# Altium schematic sheet ADC.SchDoc: Analog to Digital Conversion
size B; DrawnBy: Jasper Yun; SheetNumber: 9; SheetTotal: 11; Competition: SAC 2021; Subteam: Avionics; University: McGill University; Location: Montreal, Quebec; Project: Avionics Project Name; MRT: McGill Rocket Team
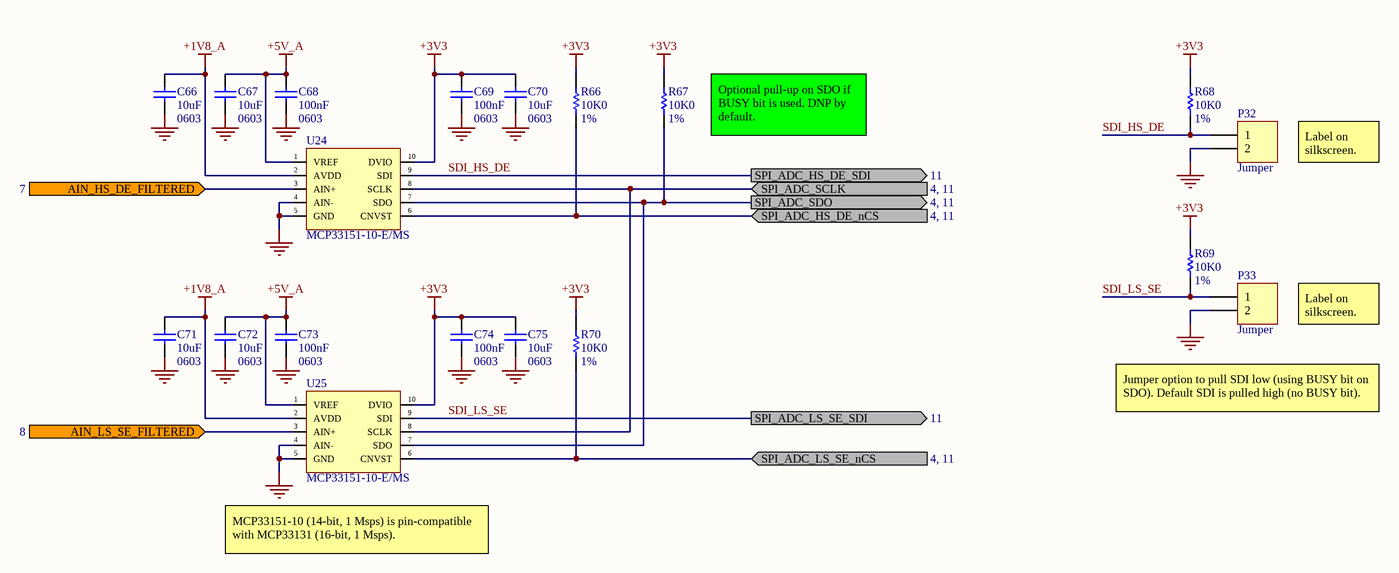
[diagram p0: ADC.SchDoc]

## Parts
C66  10uF  value 0603  [0603 CAP SAMSUNG CL10C]
C67  10uF  value 0603  [0603 CAP SAMSUNG CL10C]
C68  100nF  value 0603  [0603 CAP SAMSUNG CL10C]
C69  100nF  value 0603  [0603 CAP SAMSUNG CL10C]
C70  10uF  value 0603  [0603 CAP SAMSUNG CL10C]
C71  10uF  value 0603  [0603 CAP SAMSUNG CL10C]
C72  10uF  value 0603  [0603 CAP SAMSUNG CL10C]
C73  100nF  value 0603  [0603 CAP SAMSUNG CL10C]
C74  100nF  value 0603  [0603 CAP SAMSUNG CL10C]
C75  10uF  value 0603  [0603 CAP SAMSUNG CL10C]
P32  Jumper  [HDR1X2]
P33  Jumper  [HDR1X2]
R66  10K0  value 1%  [0603 RES]
R67  10K0  value 1%  [0603 RES]
R68  10K0  value 1%  [0603 RES]
R69  10K0  value 1%  [0603 RES]
R70  10K0  value 1%  [0603 RES]
U24  MCP33151-10-E/MS  [MSOP-10]
U25  MCP33151-10-E/MS  [MSOP-10]

## Ports
AIN_HS_DE_FILTERED (in, see 7), AIN_LS_SE_FILTERED (in, see 8), SPI_ADC_HS_DE_nCS (in, see 4, 11), SPI_ADC_HS_DE_SDI (out, see 11), SPI_ADC_LS_SE_nCS (in, see 4, 11), SPI_ADC_LS_SE_SDI (out, see 11), SPI_ADC_SCLK (in, see 4, 11), SPI_ADC_SDO (out, see 4, 11)

## Nets
+1V8_A: C66.2 C71.2 U24.2(AVDD) U25.2(AVDD)
+3V3: C69.2 C70.2 C74.2 C75.2 R66.2 R67.2 R68.2 R69.2 R70.2 U24.10(DVIO) U25.10(DVIO)
+5V_A: C67.2 C68.2 C72.2 C73.2 U24.1(VREF) U25.1(VREF)
GND: C66.1 C67.1 C68.1 C69.1 C70.1 C71.1 C72.1 C73.1 C74.1 C75.1 P32.2 P33.2 U24.4(AIN-) U24.5(GND) U25.4(AIN-) U25.5(GND)
AIN_HS_DE_FILTERED: U24.3(AIN+) ; port AIN_HS_DE_FILTERED
AIN_LS_SE_FILTERED: U25.3(AIN+) ; port AIN_LS_SE_FILTERED
SDI_HS_DE: P32.1 R68.1 U24.9(SDI) ; port SPI_ADC_HS_DE_SDI
SDI_LS_SE: P33.1 R69.1 U25.9(SDI) ; port SPI_ADC_LS_SE_SDI
SPI_ADC_HS_DE_nCS: R66.1 U24.6(CNVST) ; port SPI_ADC_HS_DE_nCS
SPI_ADC_LS_SE_nCS: R70.1 U25.6(CNVST) ; port SPI_ADC_LS_SE_nCS
SPI_ADC_SCLK: U24.8(SCLK) U25.8(SCLK) ; port SPI_ADC_SCLK
SPI_ADC_SDO: R67.1 U24.7(SDO) U25.7(SDO) ; port SPI_ADC_SDO

## Notes on the sheet
- (near R67) Optional pull-up on SDO if BUSY bit is used. DNP by default.
- Label on silkscreen.
- Jumper option to pull SDI low (using BUSY bit on SDO). Default SDI is pulled high (no BUSY bit).
- (near U25) MCP33151-10 (14-bit, 1 Msps) is pin-compatible with MCP33131 (16-bit, 1 Msps).
- Title
- Size:
- Date:
- B
- Revision:
- Time:
- Drawn By:
- Sheet
- of
- File:

## Library data of the parts
C66-C75 = Cap: Capacitor; Published: 8-Jun-2000; LatestRevisionDate: 17-Jul-2002; LatestRevisionNote: Re-released for DXP Platform.; PackageReference: RAD-0.3; Publisher: Altium Limited; PackageDescription: Radial Cap, Thru-Hole; 2 Leads; 0.3 in Pin Spacing
P32 P33 = Header 2: Header, 2-Pin; LatestRevisionDate: 17-Jul-2002; LatestRevisionNote: Re-released for DXP Platform.; Publisher: Altium Limited
R66-R70 = Res1: Resistor; Published: 8-Jun-2000; LatestRevisionDate: 17-Jul-2002; LatestRevisionNote: Re-released for DXP Platform.; PackageReference: AXIAL-0.3; Publisher: Altium Limited; PackageDescription: Axial Device, Thru-Hole; 2 Leads; 0.3 in Pin Spacing
U24 U25 = ADC MCP33151: ADC 14-bit SAR 1Msps 10-MSOP; Manufacturer: Microchip; Supplier 1: Arrow Electronics; Manufacturer Part Number: MCP33151-10-E/MS; RoHS: No; Category: Analog to Digital Converters (ADCs); Stock 1: 90; Pricing 1: 1=2.20600 (USD); Supplier Part Number 1: MCP33151-10-E/MS